# Altium schematic sheet Z7_BLOCK.SchDoc
size A4
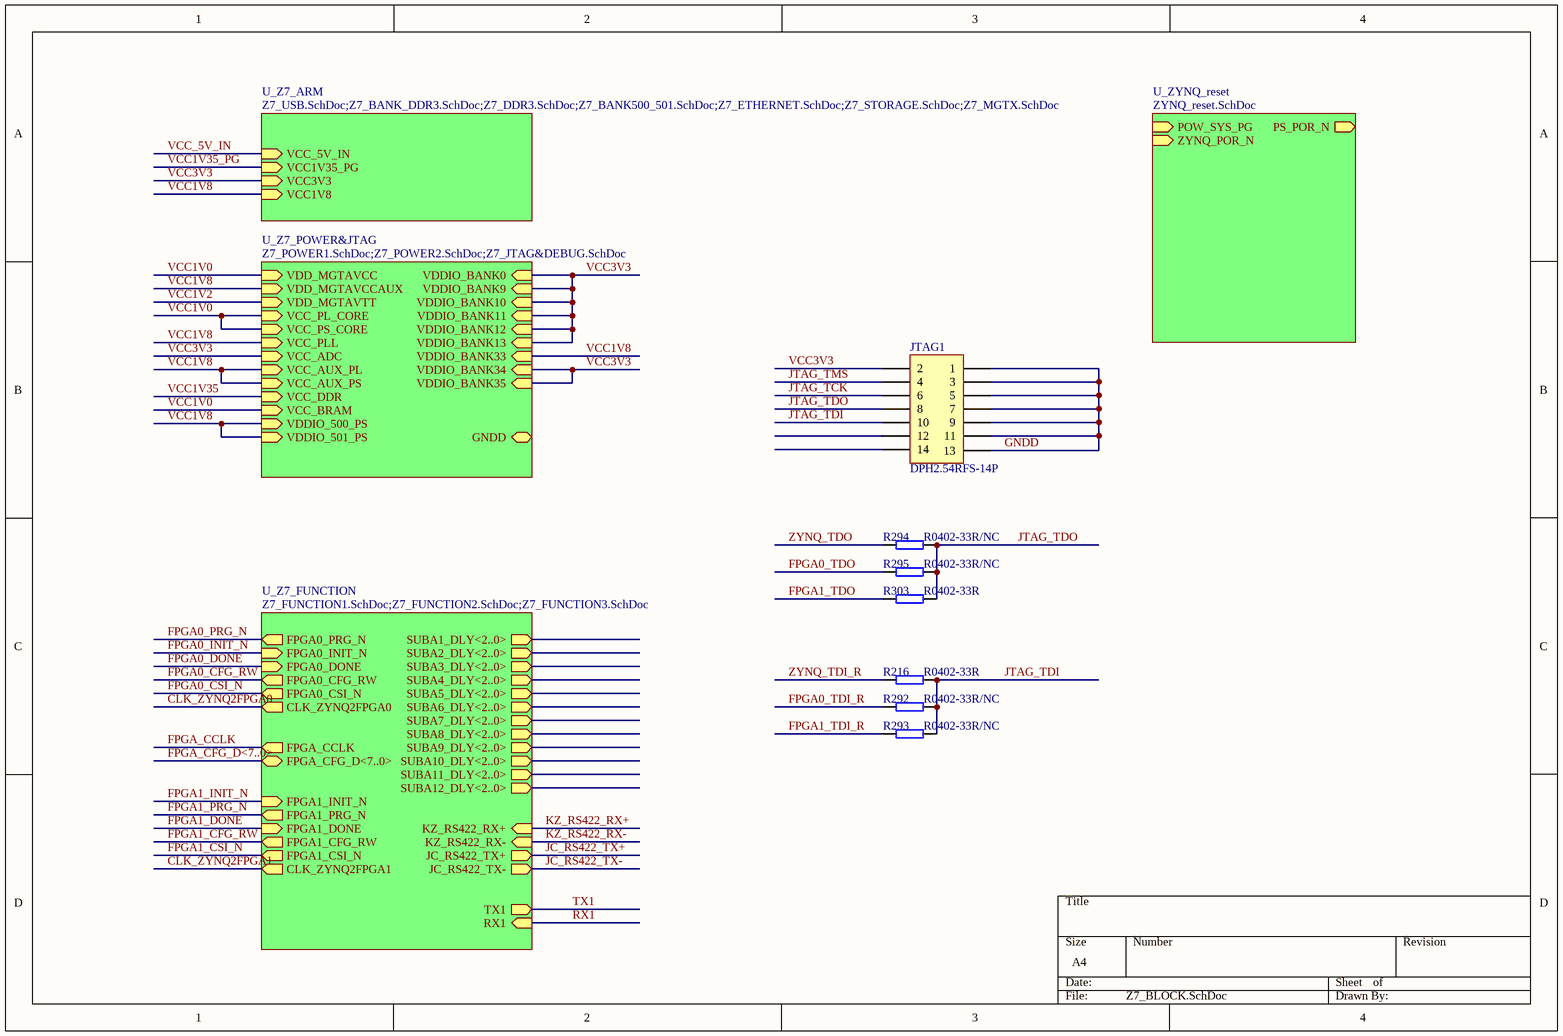
[diagram p0: Z7_BLOCK.SchDoc]

## Parts
JTAG1  DPH2.54RFS-14P  [IDC2.54-14]
R216  R0402-33R  [R0402]
R292  R0402-33R/NC  [R0402]
R293  R0402-33R/NC  [R0402]
R294  R0402-33R/NC  [R0402]
R295  R0402-33R/NC  [R0402]
R303  R0402-33R  [R0402]

## Sub-sheets
U_Z7_ARM = Z7_USB.SchDoc;Z7_BANK_DDR3.SchDoc;Z7_DDR3.SchDoc;Z7_BANK500_501.SchDoc;Z7_ETHERNET.SchDoc;Z7_STORAGE.SchDoc;Z7_MGTX.SchDoc: VCC_5V_IN (in), VCC1V35_PG (in), VCC3V3 (in), VCC1V8 (in)
U_Z7_FUNCTION = Z7_FUNCTION1.SchDoc;Z7_FUNCTION2.SchDoc;Z7_FUNCTION3.SchDoc: FPGA0_PRG_N (out), FPGA0_INIT_N (in), FPGA0_DONE (in), FPGA0_CFG_RW (out), FPGA0_CSI_N (out), FPGA_CCLK (out), FPGA_CFG_D<7..0> (bidir), JC_RS422_TX+ (out), JC_RS422_TX- (out), KZ_RS422_RX- (in), KZ_RS422_RX+ (in), FPGA1_INIT_N (in), FPGA1_PRG_N (out), FPGA1_DONE (in), FPGA1_CFG_RW (out), FPGA1_CSI_N (out), CLK_ZYNQ2FPGA0 (out), CLK_ZYNQ2FPGA1 (out), SUBA1_DLY<2..0> (out), SUBA2_DLY<2..0> (out), SUBA3_DLY<2..0> (out), SUBA4_DLY<2..0> (out), SUBA5_DLY<2..0> (out), SUBA6_DLY<2..0> (out), SUBA7_DLY<2..0> (out), SUBA8_DLY<2..0> (out), SUBA9_DLY<2..0> (out), SUBA10_DLY<2..0> (out), SUBA11_DLY<2..0> (out), SUBA12_DLY<2..0> (out), TX1 (out), RX1 (in)
U_Z7_POWER&JTAG = Z7_POWER1.SchDoc;Z7_POWER2.SchDoc;Z7_JTAG&DEBUG.SchDoc: VDD_MGTAVCC (in), VDD_MGTAVCCAUX (in), VDD_MGTAVTT (in), VCC_PL_CORE (in), VCC_PS_CORE (in), VDDIO_501_PS (in), VCC_PLL (in), VCC_ADC (in), VCC_AUX_PL (in), VCC_AUX_PS (in), VCC_DDR (in), VCC_BRAM (in), VDDIO_500_PS (in), GNDD, VDDIO_BANK0 (in), VDDIO_BANK9 (in), VDDIO_BANK10 (in), VDDIO_BANK11 (in), VDDIO_BANK13 (in), VDDIO_BANK33 (in), VDDIO_BANK34 (in), VDDIO_BANK35 (in), VDDIO_BANK12 (in)
U_ZYNQ_reset = ZYNQ_reset.SchDoc: POW_SYS_PG (in), ZYNQ_POR_N (in), PS_POR_N (out)

## Nets
CLK_ZYNQ2FPGA0: sheet U_Z7_FUNCTION/CLK_ZYNQ2FPGA0
CLK_ZYNQ2FPGA1: sheet U_Z7_FUNCTION/CLK_ZYNQ2FPGA1
FPGA0_CFG_RW: sheet U_Z7_FUNCTION/FPGA0_CFG_RW
FPGA0_CSI_N: sheet U_Z7_FUNCTION/FPGA0_CSI_N
FPGA0_DONE: sheet U_Z7_FUNCTION/FPGA0_DONE
FPGA0_INIT_N: sheet U_Z7_FUNCTION/FPGA0_INIT_N
FPGA0_PRG_N: sheet U_Z7_FUNCTION/FPGA0_PRG_N
FPGA0_TDI_R: R292.1
FPGA0_TDO: R295.1
FPGA1_CFG_RW: sheet U_Z7_FUNCTION/FPGA1_CFG_RW
FPGA1_CSI_N: sheet U_Z7_FUNCTION/FPGA1_CSI_N
FPGA1_DONE: sheet U_Z7_FUNCTION/FPGA1_DONE
FPGA1_INIT_N: sheet U_Z7_FUNCTION/FPGA1_INIT_N
FPGA1_PRG_N: sheet U_Z7_FUNCTION/FPGA1_PRG_N
FPGA1_TDI_R: R293.1
FPGA1_TDO: R303.1
FPGA_CCLK: sheet U_Z7_FUNCTION/FPGA_CCLK
GNDD: JTAG1.1 JTAG1.3 JTAG1.5 JTAG1.7 JTAG1.9 JTAG1.11 JTAG1.13
JC_RS422_TX+: sheet U_Z7_FUNCTION/JC_RS422_TX+
JC_RS422_TX-: sheet U_Z7_FUNCTION/JC_RS422_TX-
JTAG_TCK: JTAG1.6
JTAG_TDI: JTAG1.10 R216.2 R292.2 R293.2
JTAG_TDO: JTAG1.8 R294.2 R295.2 R303.2
JTAG_TMS: JTAG1.4
KZ_RS422_RX+: sheet U_Z7_FUNCTION/KZ_RS422_RX+
KZ_RS422_RX-: sheet U_Z7_FUNCTION/KZ_RS422_RX-
RX1: sheet U_Z7_FUNCTION/RX1
TX1: sheet U_Z7_FUNCTION/TX1
VCC1V0: sheet U_Z7_POWER&JTAG/VDD_MGTAVCC, sheet U_Z7_POWER&JTAG/VCC_PL_CORE, sheet U_Z7_POWER&JTAG/VCC_PS_CORE, sheet U_Z7_POWER&JTAG/VCC_BRAM
VCC1V2: sheet U_Z7_POWER&JTAG/VDD_MGTAVTT
VCC1V8: sheet U_Z7_POWER&JTAG/VDD_MGTAVCCAUX, sheet U_Z7_POWER&JTAG/VDDIO_501_PS, sheet U_Z7_POWER&JTAG/VCC_PLL, sheet U_Z7_POWER&JTAG/VCC_AUX_PL, sheet U_Z7_POWER&JTAG/VCC_AUX_PS, sheet U_Z7_POWER&JTAG/VDDIO_500_PS, sheet U_Z7_POWER&JTAG/VDDIO_BANK33, sheet U_Z7_ARM/VCC1V8
VCC1V35: sheet U_Z7_POWER&JTAG/VCC_DDR
VCC1V35_PG: sheet U_Z7_ARM/VCC1V35_PG
VCC3V3: JTAG1.2 ; sheet U_Z7_POWER&JTAG/VCC_ADC, sheet U_Z7_POWER&JTAG/VDDIO_BANK0, sheet U_Z7_POWER&JTAG/VDDIO_BANK9, sheet U_Z7_POWER&JTAG/VDDIO_BANK10, sheet U_Z7_POWER&JTAG/VDDIO_BANK11, sheet U_Z7_POWER&JTAG/VDDIO_BANK13, sheet U_Z7_POWER&JTAG/VDDIO_BANK34, sheet U_Z7_POWER&JTAG/VDDIO_BANK35, sheet U_Z7_POWER&JTAG/VDDIO_BANK12, sheet U_Z7_ARM/VCC3V3
VCC_5V_IN: sheet U_Z7_ARM/VCC_5V_IN
ZYNQ_TDI_R: R216.1
ZYNQ_TDO: R294.1

Not connected (* = marked no-connect by the designer): JTAG1 12 14

## Buses and harness runs
bus FPGA_CFG_D<7..0> = sheet U_Z7_FUNCTION/FPGA_CFG_D<7..0>

## Library data of the parts
JTAG1 = DPH2.54RFS-14P: 2.54间距14芯双排插针; Part_type: CONNECTOR; Manufacture: ANYCONN; Revision: 17-Jul-2002: Re-released for DXP Platform.; Part_number: DPH2.54RFS-14P; Value: DPH2.54RFS-14P; Schematic_Part: DPH2.54RFS-14P; PCB_Footprint: IDC2.54-14; datasheet: DataSheet\CON_ANYCONN_2.54 直针座.pdf#DataSheet\CON_ANYCONN_2.54%20直针座.pdf#
R216 R292-R295 R303 = R0402-10K: Manufacturer: SAMSUNG; Part_type: RES; Schematic_Part: RES; PCB_Footprint: R0402
  R216 R303: Part_number: R0402-33R; Value: R0402-33R
  R292-R295: Part_number: R0402-33R/NC; Value: R0402-33R/NC